# EAGLE design Programmer_CH340G v1.0 (EAGLE 7.6.0)
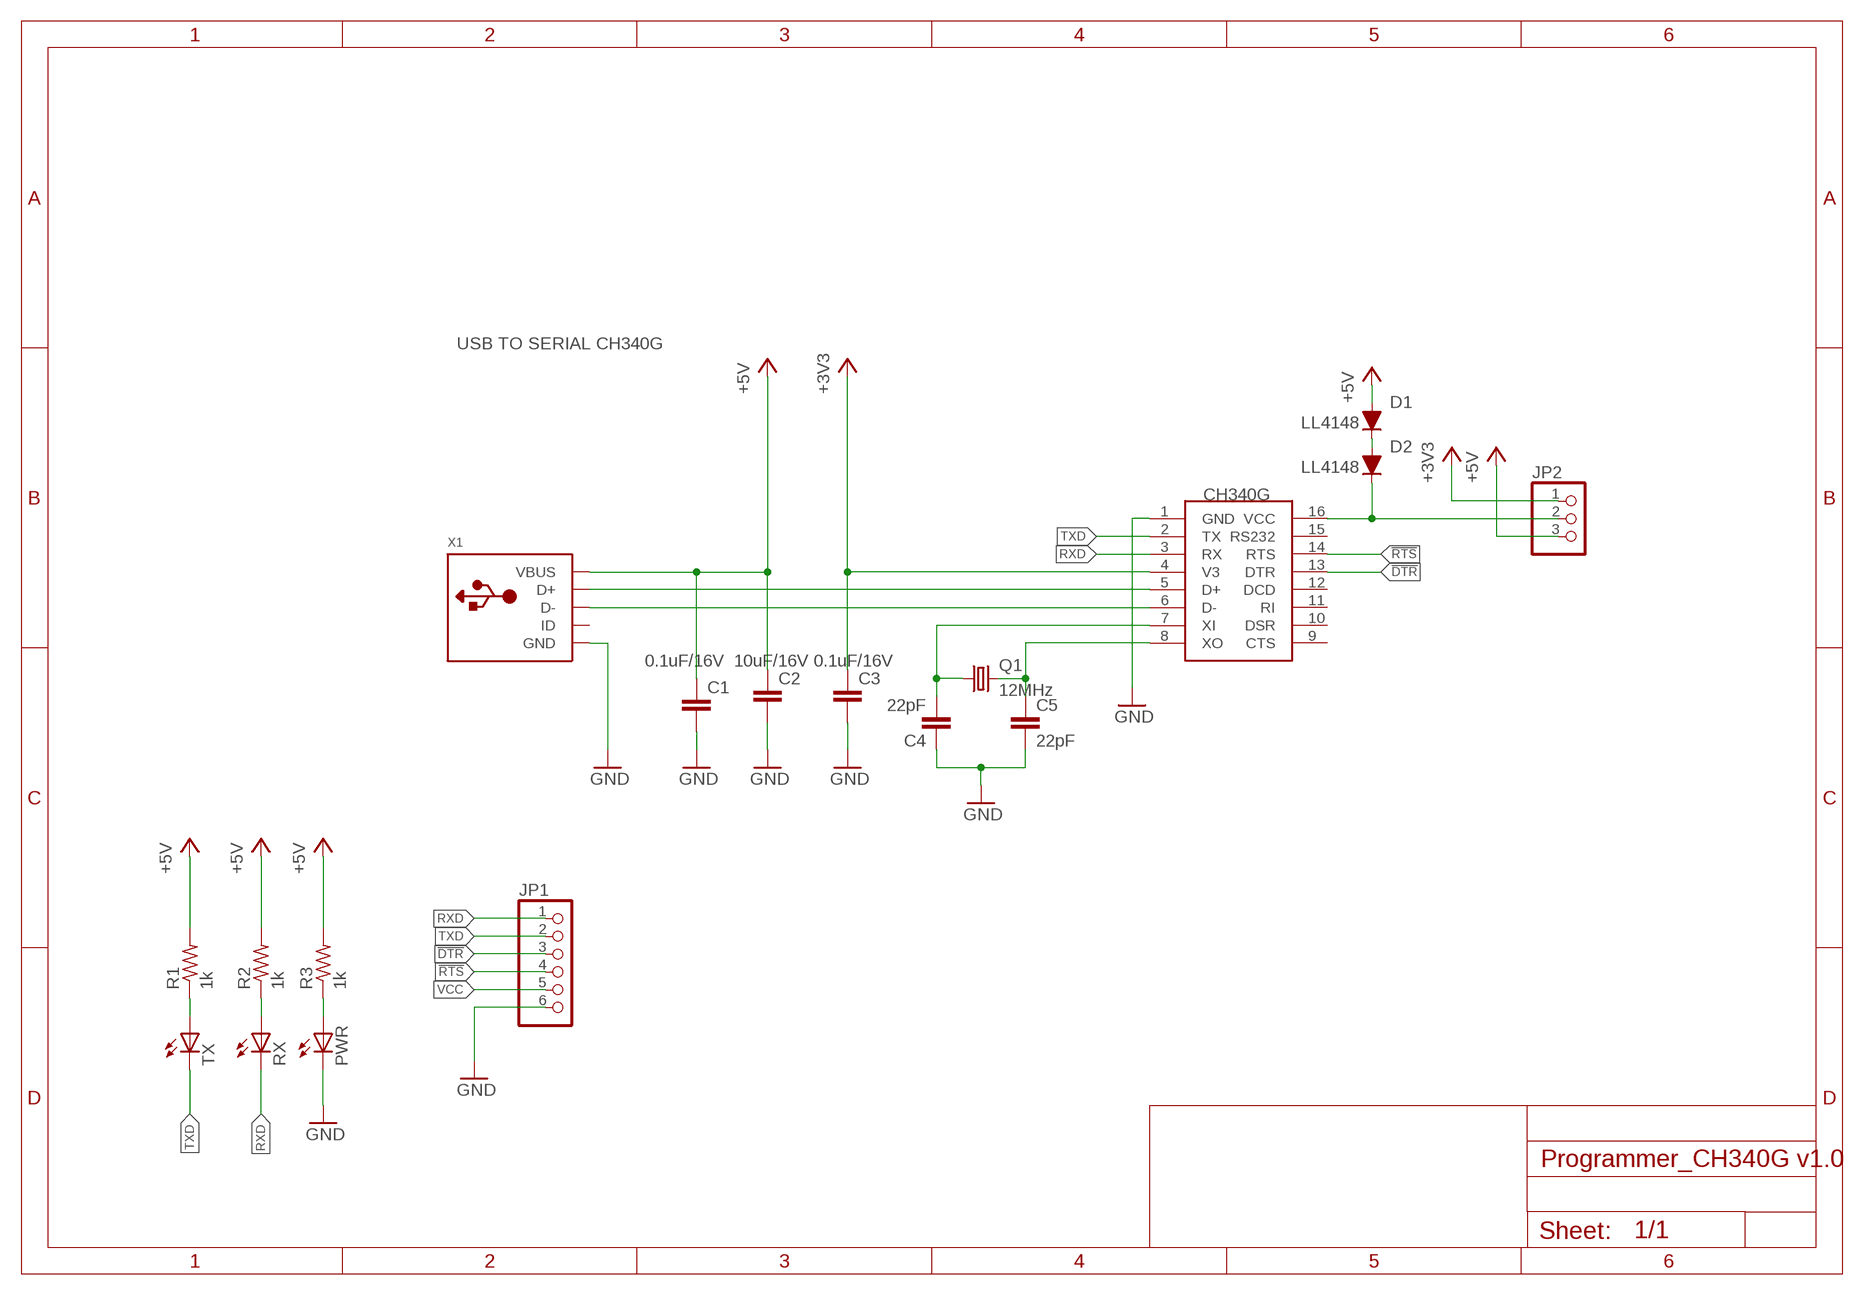
[diagram p0: schematic, sheet 1]

## Parts
C1  0.1uF/16V  C-EUC0805K  [C0805K]
C2  10uF/16V  C-EUC0805K  [C0805K]
C3  0.1uF/16V  C-EUC0805K  [C0805K]
C4  22pF  C-EUC0805K  [C0805K]
C5  22pF  C-EUC0805K  [C0805K]
D1  LL4148  D-FILL-SOD-80  [SOD80]
D2  LL4148  D-FILL-SOD-80  [SOD80]
JP1  PINHD-1X6  [1X06]
JP2  PINHD-1X3  [1X03]
PWR  LEDCHIP-LED0805  [CHIP-LED0805]
Q1  12MHz  CRYSTALHC49U-V  [HC49U-V]
R1  1k  R-US_M0805  [M0805]
R2  1k  R-US_M0805  [M0805]
R3  1k  R-US_M0805  [M0805]
RX  LEDCHIP-LED0805  [CHIP-LED0805]
TX  LEDCHIP-LED0805  [CHIP-LED0805]
U1  CH340G  [SOIC16]
X1  USB_MICRO_20329_V2  [4UCONN_20329_V2]

## Nets
!DTR: JP1.3 U1.13(DTR)
!RTS: JP1.4 U1.14(RTS)
+3V3: C3.1 JP2.1 U1.4(V3)
+5V: C1.1 C2.1 D1.2(A) JP2.3 R3.2 X1.VBUS
GND: C1.2 C2.2 C3.2 C4.1 C5.2 JP1.6 PWR.C U1.1(GND) X1.BASE@1(GND) X1.BASE@2(GND) X1.GND X1.SPRT@1(GND) X1.SPRT@2(GND) X1.SPRT@3(GND) X1.SPRT@4(GND)
N$1: PWR.A R3.1
N$2: C4.2 Q1.1 U1.7(XI)
N$5: D1.1(C) D2.2(A)
N$6: C5.1 Q1.2 U1.8(XO)
N$7: U1.5(D+) X1.D+
N$8: U1.6(D-) X1.D-
N$9: R1.1 TX.A
N$11: R2.1 RX.A
RXD: JP1.1 RX.C U1.3(RX)
TXD: JP1.2 TX.C U1.2(TX)
VCC: D2.1(C) JP1.5 JP2.2 R1.2 R2.2 U1.16(VCC) ; supply symbol labelled +5V
Unconnected: U1.9(CTS) U1.10(DSR) U1.11(RI) U1.12(DCD) U1.15(RS232) X1.ID

## Notes on the sheet
- USB TO SERIAL CH340G

## Library data of the parts
C1-C5 = rcl:C-EU: CAPACITOR, European symbol
D1 D2 = semicon-smd-ipc:D-FILL-: DIODE filled
JP1 = pinhead:PINHD-1X6: PIN HEADER
JP2 = pinhead:PINHD-1X3: PIN HEADER
PWR RX TX = led:LED: LED OSRAM: - CHIPLED LG R971, LG N971, LY N971, LG Q971, LY Q971, LO R971, LY R971 LH N974, LH R974 LS Q976, LO Q976, LY Q976 LO Q996 - Hyper CHIPLED LW Q18S LB Q993, LB Q99A, LB R99A - SideLED LS A670, LO A670, LY A670, LG A670, LP A670 LB A673, LV A673, LT A673, LW A673 LH A674 LY A675 LS A676, LA A676, LO A676, LY A676, LW A676 LS A679, LY A679, LG A679 - Hyper Micro SIDELED® LS Y876, LA Y876, LO Y876, LY Y876 LT Y87S - SmartLED LW L88C, LW L88S LB L89C, LB L89S, LG L890 LS L89K, LO L89K, LY L89K LS L896, LA L896, LO L896, LY L896 - TOPLED LS T670, LO T670, LY T670, LG T670, LP T670 LSG T670, LSP T670, LSY T670, LOP T670, LYG T670 LG T671, LOG T671, LSG T671 LB T673, LV T673, LT T673, LW T673 LH T674 LS T676, LA T676, LO T676, LY T676, LB T676, LH T676, LSB T676, LW T676 LB T67C, LV T67C, LT T67C, LS T67K, LO T67K, LY T67K, LW E67C LS E67B, LA E67B, LO E67B, LY E67B, LB E67C, LV E67C, LT E67C LW T67C LS T679, LY T679, LG T679 LS T770, LO T770, LY T770, LG T770, LP T770 LB T773, LV T773, LT T773, LW T773 LH T774 LS E675, LA E675, LY E675, LS T675 LS T776, LA T776, LO T776, LY T776, LB T776 LHGB T686 LT T68C, LB T68C - Hyper Mini TOPLED® LB M676 - Mini TOPLED Santana® LG M470 LS M47K, LO M47K, LY M47K Source: http://www.osram.convergy.de LUXEON: - LUMILED® LXK2-PW12-R00, LXK2-PW12-S00, LXK2-PW14-U00, LXK2-PW14-V00 LXK2-PM12-R00, LXK2-PM12-S00, LXK2-PM14-U00 LXK2-PE12-Q00, LXK2-PE12-R00, LXK2-PE12-S00, LXK2-PE14-T00, LXK2-PE14-U00 LXK2-PB12-K00, LXK2-PB12-L00, LXK2-PB12-M00, LXK2-PB14-N00, LXK2-PB14-P00, LXK2-PB14-Q00 LXK2-PR12-L00, LXK2-PR12-M00, LXK2-PR14-Q00, LXK2-PR14-R00 LXK2-PD12-Q00, LXK2-PD12-R00, LXK2-PD12-S00 LXK2-PH12-R00, LXK2-PH12-S00 LXK2-PL12-P00, LXK2-PL12-Q00, LXK2-PL12-R00 Source: www.luxeon.com KINGBRIGHT: KA-3528ASYC Source: www.kingbright.com
Q1 = crystal:CRYSTAL: CRYSTAL; OC_FARNELL: 1666969; OC_NEWARK: unknown
R1-R3 = rcl:R-US_: RESISTOR, American symbol
U1 = ch340g:CH340G
X1 = Adafruit SIM808 Breakout:USB: USB Connectors USBMINIB - Surface Mount Female Mini-B USB Connector 4UConnector: 06564

## Net classes
0 default: width 0.203 mm, drill 0.356 mm, clearance 0.203 mm

## Board
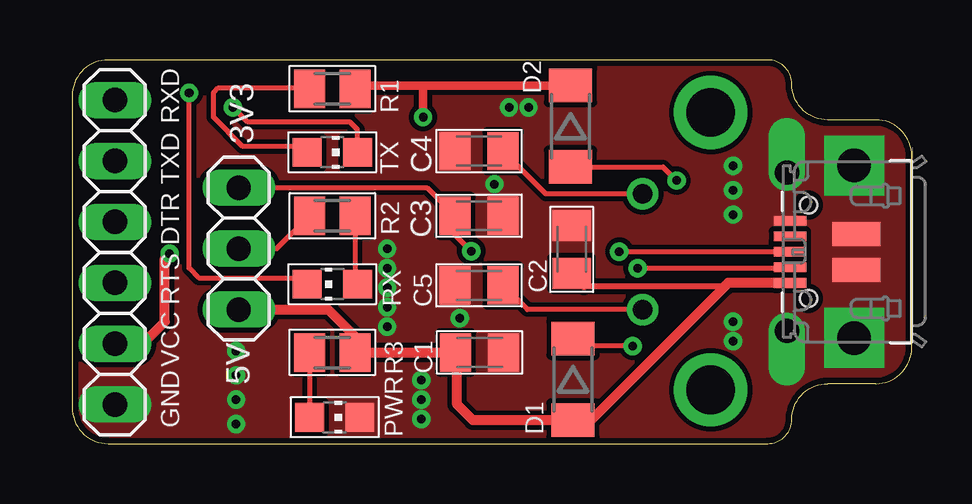
[diagram p1: board, top side]
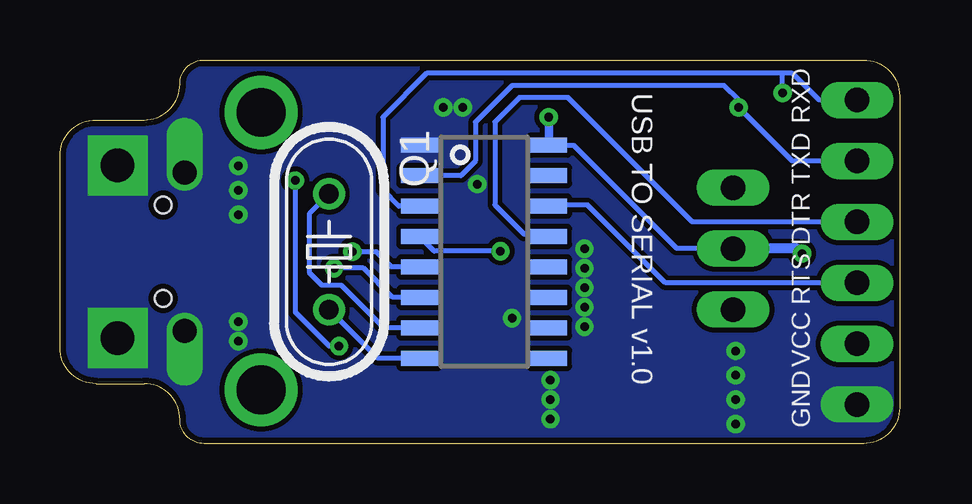
[diagram p2: board, bottom side, seen from below]

Size 35 x 16 mm. Coordinates in mm from the lower left corner, seen from the top.
Outline: 1.5,0 29,0 arc90 30,1 arc-90 31.5,2.5 33.5,2.5 arc90 35,4 35,12 arc90 33.5,13.5 31.5,13.5 arc-90 30,15 arc90 29,16 1.5,16 arc90 0,14.5 0,1.5 arc90 1.5,0
Copper layers (1*16): Top 0.035mm / dielectric 1.5mm / Bottom 0.035mm
Design rules "default *": minimum track width 8mil, minimum drill 14mil, track to track 8mil, track to pad 8mil, pad to pad 8mil, via to via 8mil, smd to smd 8mil, copper to edge 10mil, drill to drill 8mil, minimum pad ring 10mil, minimum via ring 8mil, stop-mask expansion 4mil, vias tented up to drill 14mil, thermal gap 10mil

### Footprints (pad centres in the part's own frame; a part is rotated, then mirrored left to right if it is on the bottom)
C0805K = smd 1.3 x 1.6: 1 -1,0; 2 1,0
SOD80 = smd 1.4 x 1.8: 1 -1.7,0; 2 1.7,0
1X06 = drill 1.016 long: 1 -6.35,0; 2 -3.81,0; 3 -1.27,0; 4 1.27,0; 5 3.81,0; 6 6.35,0
1X03 = drill 1.016 long: 1 -2.54,0; 2 0,0; 3 2.54,0
CHIP-LED0805 = smd 1.2 x 1.2: A 0,-1.05; C 0,1.05
HC49U-V = drill 0.813: 1 -2.413,0; 2 2.413,0
M0805 = smd 1.3 x 1.6: 1 -0.95,0; 2 0.95,0
SOIC16 = smd 0.635 x 1.524: 1 -4.445,-2.695; 2 -3.175,-2.695; 3 -1.905,-2.695; 4 -0.635,-2.695; 5 0.635,-2.695; 6 1.905,-2.695; 7 3.175,-2.695; 8 4.445,-2.695; 9 4.445,2.695; 10 3.175,2.695; 11 1.905,2.695; 12 0.635,2.695; 13 -0.635,2.695; 14 -1.905,2.695; 15 -3.175,2.695; 16 -4.445,2.695
4UCONN_20329_V2 = smd 1 x 2: BASE@1 -0.75,-2; BASE@2 0.75,-2 | smd 0.4 x 1.35: D+ 0,0.775; D- -0.65,0.775; GND 1.3,0.775; ID 0.65,0.775; VBUS -1.3,0.775 | drill 1.016 pad 1.454 offset: SPRT@1 -3.3,0.9; SPRT@2 3.3,0.9 | drill 1.397 pad 2.5 square: SPRT@3 -3.6,-1.9; SPRT@4 3.6,-1.9 | hole 0.7: -1.95,0; 1.95,0

### Placement (x,y rotation side)
C1  16.98,3.8 0 top
C2  20.82,8.1 90 top
C3  16.96,9.5 0 top
C4  16.96,12.2 0 top
C5  16.96,6.6 180 top
D1  20.88,2.68 270 top
D2  20.77,13.24 270 top
JP1  1.78,7.98 270 top
JP2  6.94,8.13 270 top
PWR  10.94,1.1 270 top
Q1  23.78,8 270 bottom
R1  10.84,14.8 0 top
R2  10.84,9.5 180 top
R3  10.84,3.8 0 top
RX  10.84,6.65 90 top
TX  10.84,12.15 270 top
U1  17.32,8 270 bottom
X1  30.7,8 90 top

### Tracks (layer width: path | path; a pad name or v marks a point on that pad's centre or on a via)
!DTR
  Bottom 0.203: JP1.3 8.64,9.25 13.82,14.43 15.85,14.43 16.87,13.41 16.87,9.96 15.65,8.74 14.72,8.74
  Bottom 0.356: 14.72,8.74 U1.13
!RTS
  Bottom 0.203: JP1.4 9.75,6.71 13.01,9.96 14.57,9.96
  Bottom 0.356: 14.57,9.96 U1.14
+3V3  (via drill 0.36 pad 0.76)
  Top 0.203: JP2.1 14.79,10.67 C3.1 15.96,8.7 v16.64,8.03
  Bottom 0.203: v16.64,8.03 19.4,8.03 U1.4
+5V
  Top 0.254: 21.34,6.58 27.23,6.58
  Top 0.356: 21.34,6.58 C2.1
  Top 0.406: JP2.3 10.66,5.59 11.79,4.47 R3.2 C1.1 16.05,3.79 16.05,1.63 16.7,0.98 D1.2 21.63,0.98 27.23,6.58 27.36,6.71 X1.VBUS | C2.1 20.94,7.1
GND  (via drill 0.36 pad 0.76)
  other vias: 17.6,10.82 16.15,5.23 14.55,1.83 27.56,11.58 27.56,10.57 27.56,9.55 27.56,5.08 27.56,4.27 14.55,2.64 14.55,1.02 6.83,0.81 6.83,1.83 6.83,2.84 6.83,3.86 13.13,8.13 13.13,7.32 13.13,6.5 13.13,5.69 13.13,4.88 18.21,14.02 19.02,14.02
  pour Top (no thermals): -0.2,16.26 35.36,16.26 35.36,-0.2 -0.2,-0.2
  pour Bottom (no thermals): -0.2,16.26 35.36,16.26 35.36,-0.2 -0.2,-0.2
N$1
  Top 0.203: R3.1 PWR.A
N$2
  Top 0.203: C4.2 19.75,10.41 Q1.1
  Bottom 0.203: U1.7 21.49,4.83 23.27,6.6 24.08,6.6 24.59,7.11 24.59,9.61 Q1.1
N$3  (via drill 2.03 pad 0.41)
  other vias: 26.62,2.24
N$4  (via drill 2.03 pad 0.41)
  other vias: 26.62,13.81
N$5  (via drill 0.36 pad 0.76)
  Top 0.203: D2.2 24.63,11.54 v25.2,10.97 | v23.37,4.06 21.19,4.06 D1.1
  Bottom 0.203: v25.2,10.97 25.2,5.49 23.77,4.06 v23.37,4.06
N$6
  Top 0.203: Q1.2 18.97,5.59 C5.1
  Bottom 0.203: U1.8 21.75,3.56 Q1.2
N$7  (via drill 0.36 pad 0.76)
  Top 0.203: X1.D+ v22.81,8
  Bottom 0.203: U1.5 21.18,7.37 21.82,8 v22.81,8
N$8  (via drill 0.36 pad 0.76)
  Top 0.203: v23.57,7.32 29.89,7.32 X1.D-
  Bottom 0.203: U1.6 21.13,6.09 22.35,7.32 v23.57,7.32
N$9
  Top 0.203: TX.A 9.75,12.19 9.75,12.39 7.11,12.39 5.89,13.61 5.89,14.63 6.1,14.83 9.86,14.83 R1.1
N$11
  Top 0.203: R2.1 11.79,6.75 RX.A
RXD  (via drill 0.36 pad 0.76)
  Top 0.203: v4.88,14.63 4.88,7.32 5.28,6.91 9.54,6.91 RX.C
  Bottom 0.203: JP1.1 3.35,14.33 4.47,15.44 4.88,15.44 | 4.88,15.44 19.71,15.44 21.54,13.61 21.54,10.57 20.88,9.9 U1.3 | v4.88,14.63 4.88,15.44
  Bottom 0.356: 19.96,9.96 U1.3
TXD  (via drill 0.36 pad 0.76)
  Top 0.203: TX.C 11.89,13.1 11.58,13.41 7.32,13.41 v6.71,14.02
  Bottom 0.203: U1.2 18.29,11.18 17.68,11.79 17.68,13.41 16.15,14.94 7.32,14.94 6.71,14.33 v6.71,14.02 4.47,11.79 JP1.2
VCC  (via drill 0.36 pad 0.76)
  Top 0.203: JP2.2 8.53,8.13 R2.2
  Top 0.356: D2.1 14.63,14.94 | 14.63,14.94 11.93,14.94 R1.2 | v14.63,13.61 14.63,14.94
  Top 0.406: JP1.5 2.95,4.17 3.86,5.08 3.86,7.72 v4.06,7.92
  Bottom 0.203: U1.16 13.59,12.45 9.3,8.15 6.96,8.15 JP2.2
  Bottom 0.356: U1.16 v14.62,13.6 v14.63,13.61
  Bottom 0.406: v4.06,7.92 4.27,8.13 JP2.2

### Text on the board
tNames: 3V3 | RXD | TXD | DTR | RTS | 5V | VCC | GND
bNames: USB TO SERIAL v1.0 | RXD | TXD | DTR | RTS | VCC | GND
bStop: 17/11/'17